# EAGLE design controlador_temperatura (EAGLE 9.6.2)
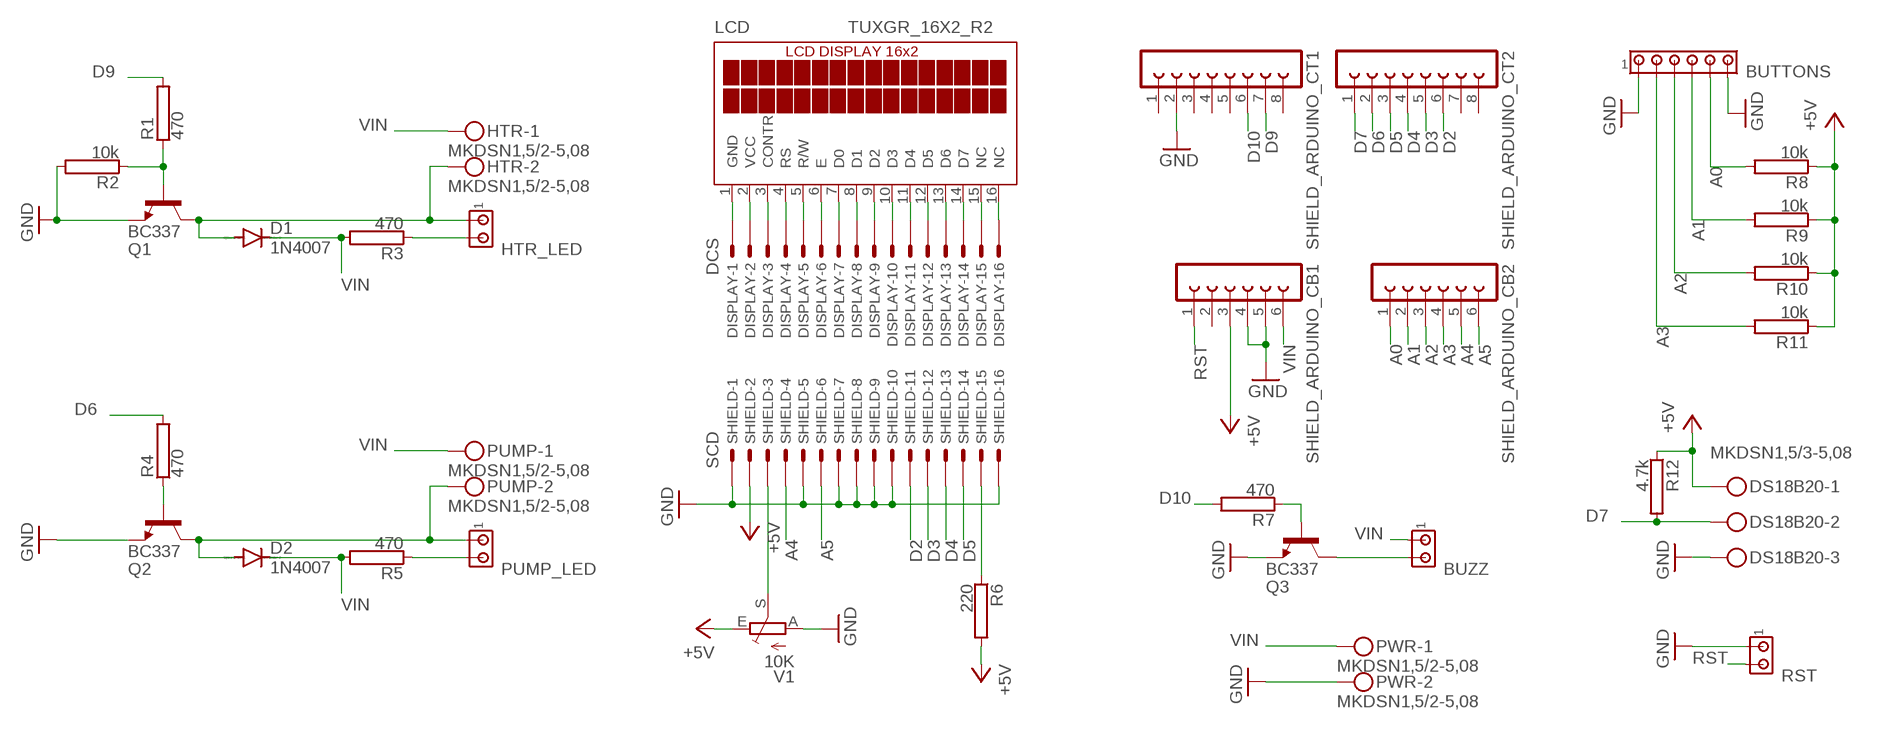
[diagram p0: schematic, sheet 1]

## Parts
BUTTONS  MTA06-100  [10X06MTA]
BUZZ  MTA02-100  [10X02MTA]
D1  1N4007  1N4004  [DO41-10]
D2  1N4007  1N4004  [DO41-10]
DISPLAY  DCS  057-016-1  [057-016-1]
DS18B20  MKDSN1,5/3-5,08  [MKDSN1,5/3-5,08]
HTR  MKDSN1,5/2-5,08  [MKDSN1,5/2-5,08]
HTR_LED  MTA02-100  [10X02MTA]
LCD  TUXGR_16X2_R2  [TUXGR_16X2_R2]
PUMP  MKDSN1,5/2-5,08  [MKDSN1,5/2-5,08]
PUMP_LED  MTA02-100  [10X02MTA]
PWR  MKDSN1,5/2-5,08  [MKDSN1,5/2-5,08]
Q1  BC337  [TO92]
Q2  BC337  [TO92]
Q3  BC337  [TO92]
R1  470  RRS1/8  [RS1/8]
R2  10k  RRS1/8  [RS1/8]
R3  470  RRS1/8  [RS1/8]
R4  470  RRS1/8  [RS1/8]
R5  470  RRS1/8  [RS1/8]
R6  220  RRS1/8  [RS1/8]
R7  470  RRS1/8  [RS1/8]
R8  10k  RRS1/8  [RS1/8]
R9  10k  RRS1/8  [RS1/8]
R10  10k  RRS1/8  [RS1/8]
R11  10k  RRS1/8  [RS1/8]
R12  4.7k  RRS1/8  [RS1/8]
RST  MTA02-100  [10X02MTA]
SHIELD  SCD  057-016-1  [057-016-1]
SHIELD_ARDUINO_CB1  FE06-1  [FE06]
SHIELD_ARDUINO_CB2  FE06-1  [FE06]
SHIELD_ARDUINO_CT1  FE08-1  [FE08]
SHIELD_ARDUINO_CT2  FE08-1  [FE08]
V1  10K  TRIM_EU-B25P  [B25P]

## Nets
A0: BUTTONS.5 R8.2 SHIELD_ARDUINO_CB2.1
A1: BUTTONS.4 R9.2 SHIELD_ARDUINO_CB2.2
A2: BUTTONS.3 R10.2 SHIELD_ARDUINO_CB2.3
A3: BUTTONS.2 R11.2 SHIELD_ARDUINO_CB2.4
A4: SHIELD.4 SHIELD_ARDUINO_CB2.5
A5: SHIELD.6 SHIELD_ARDUINO_CB2.6
D2: SHIELD.11 SHIELD_ARDUINO_CT2.6
D3: SHIELD.12 SHIELD_ARDUINO_CT2.5
D4: SHIELD.13 SHIELD_ARDUINO_CT2.4
D5: SHIELD.14 SHIELD_ARDUINO_CT2.3
D6: R4.2 SHIELD_ARDUINO_CT2.2
D7: DS18B20.2 R12.2 SHIELD_ARDUINO_CT2.1
D9: R1.2 SHIELD_ARDUINO_CT1.7
D10: R7.2 SHIELD_ARDUINO_CT1.6
GND: BUTTONS.1 BUTTONS.6 DS18B20.3 PWR.2 Q1.1(E) Q2.1(E) Q3.1(E) R2.2 RST.1 SHIELD.1 SHIELD.5 SHIELD.7 SHIELD.8 SHIELD.9 SHIELD.10 SHIELD.16 SHIELD_ARDUINO_CB1.4 SHIELD_ARDUINO_CB1.5 SHIELD_ARDUINO_CT1.2 V1.A
N$1: Q1.2(B) R1.1 R2.1
N$2: Q2.2(B) R4.1
N$3: D1.A HTR.2 HTR_LED.1 Q1.3(C)
N$4: D2.A PUMP.2 PUMP_LED.1 Q2.3(C)
N$5: HTR_LED.2 R3.1
N$6: PUMP_LED.2 R5.1
N$7: DISPLAY.1 LCD.1(GND)
N$8: Q3.2(B) R7.1
N$9: BUZZ.2 Q3.3(C)
N$10: DISPLAY.2 LCD.2(VCC)
N$11: DISPLAY.3 LCD.3(CONTR)
N$12: DISPLAY.4 LCD.4(RS)
N$13: DISPLAY.5 LCD.5(R/W)
N$14: DISPLAY.6 LCD.6(E)
N$15: DISPLAY.7 LCD.7(D0)
N$16: DISPLAY.8 LCD.8(D1)
N$17: DISPLAY.9 LCD.9(D2)
N$18: DISPLAY.10 LCD.10(D3)
N$19: DISPLAY.11 LCD.11(D4)
N$20: DISPLAY.12 LCD.12(D5)
N$21: DISPLAY.13 LCD.13(D6)
N$22: DISPLAY.14 LCD.14(D7)
N$23: DISPLAY.15 LCD.15(NC)
N$24: DISPLAY.16 LCD.16(NC)
N$25: R6.1 SHIELD.15
N$26: SHIELD.3 V1.S
RST: RST.2 SHIELD_ARDUINO_CB1.1
VCC: DS18B20.1 R6.2 R8.1 R9.1 R10.1 R11.1 R12.1 SHIELD.2 SHIELD_ARDUINO_CB1.3 V1.E ; supply symbol labelled +5V
VIN: BUZZ.1 D1.C D2.C HTR.1 PUMP.1 PWR.1 R3.2 R5.2 SHIELD_ARDUINO_CB1.6
Unconnected: SHIELD_ARDUINO_CB1.2 SHIELD_ARDUINO_CT1.1 SHIELD_ARDUINO_CT1.3 SHIELD_ARDUINO_CT1.4 SHIELD_ARDUINO_CT1.5 SHIELD_ARDUINO_CT1.8 SHIELD_ARDUINO_CT2.7 SHIELD_ARDUINO_CT2.8

## Library data of the parts
BUTTONS = con-amp:MTA06-100: AMP connector Connection corrected 2014-09-19
BUZZ HTR_LED PUMP_LED RST = con-amp:MTA02-100: AMP connector
D1 D2 = diode:1N4004: DIODE general purpose rectifier, 1 A
DISPLAY SHIELD = con-panduit:057-016-: CONNECTOR 10-pin series 057 contact pc board low profile headers; OC_FARNELL: unknown; OC_NEWARK: unknown
DS18B20 = con-phoenix-508:MKDSN1,5/3-5,08: MKDSN 1,5/ 3-5,08 Printklemme Nennstrom: 13,5 A Nennspannung: 250 V Rastermaß: 5,08 mm Polzahl: 3 Anschlussart: Schraubanschluss Montage: Löten Anschlussrichtung Leiter/Platine: 0 ° Artikelnummer: 1729131 Source: http://eshop.phoenixcontact.com .. 1729131.pdf
HTR PUMP PWR = con-phoenix-508:MKDSN1,5/2-5,08: MKDSN 1,5/ 2-5,08 Printklemme Nennstrom: 13,5 A Nennspannung: 250 V Rastermaß: 5,08 mm Polzahl: 2 Anschlussart: Schraubanschluss Montage: Löten Anschlussrichtung Leiter/Platine: 0 ° Artikelnummer: 1729128 Source: http://eshop.phoenixcontact.com .. 1729128.pdf
LCD = display-lcd:TUXGR_16X2_R2: Tuxgraphics LCD display 16x2 characters reflective, without background light Source: tuxgr_12x2_r2.pdf; OC_FARNELL: unknown; OC_NEWARK: unknown
Q1-Q3 = transistor-npn:BC337*: NPN Transistor
R1-R12 = resistor-power:R: Power Resitor; OC_FARNELL: unknown; OC_NEWARK: unknown
SHIELD_ARDUINO_CB1 SHIELD_ARDUINO_CB2 = con-lsta:FE06-1: FEMALE HEADER; OC_FARNELL: unknown; OC_NEWARK: unknown
SHIELD_ARDUINO_CT1 SHIELD_ARDUINO_CT2 = con-lsta:FE08-1: FEMALE HEADER; OC_FARNELL: unknown; OC_NEWARK: unknown
V1 = pot:TRIM_EU-: POTENTIOMETER

## Board
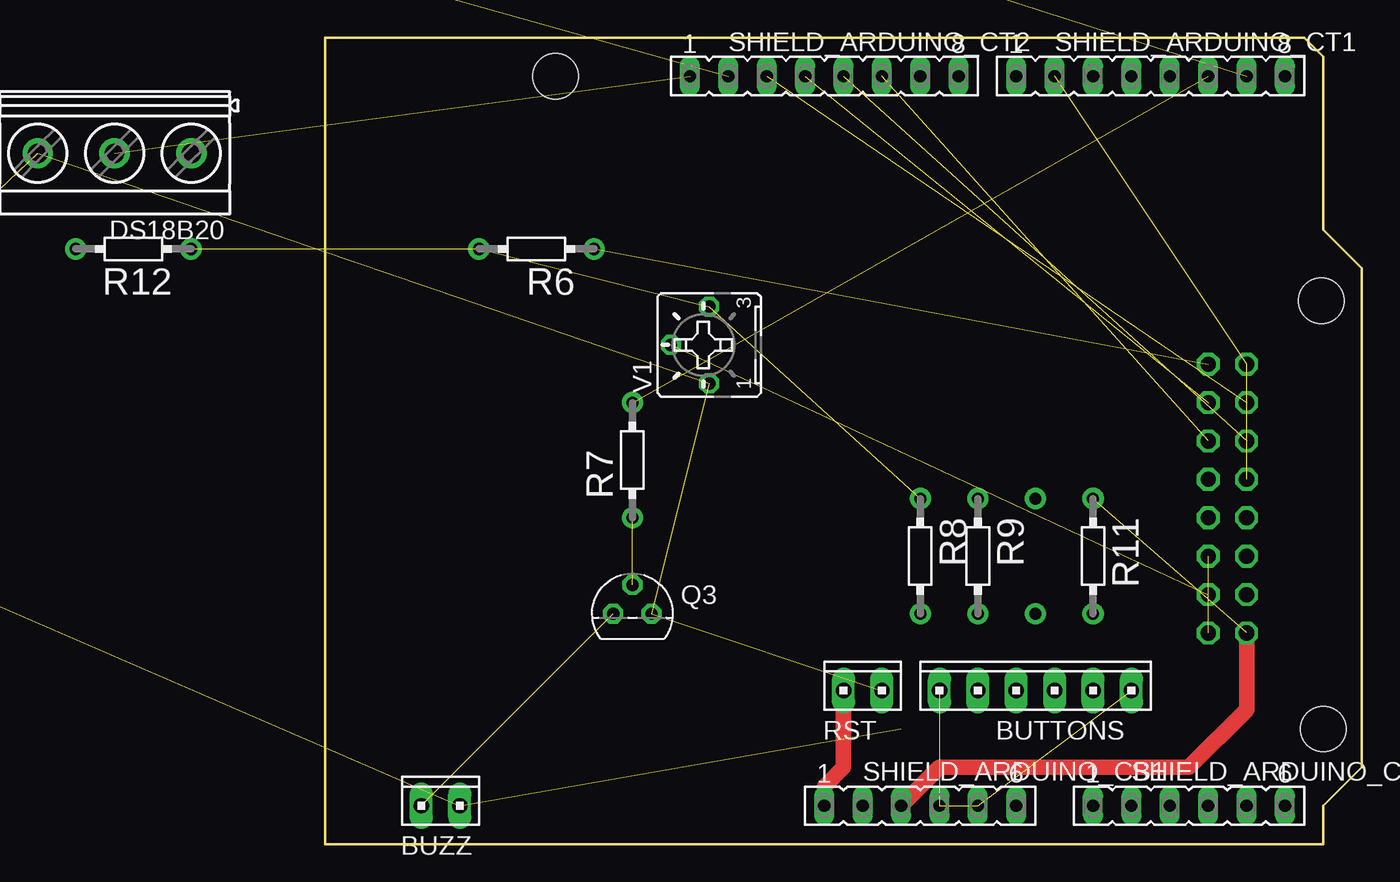
[diagram p1: board, top side]
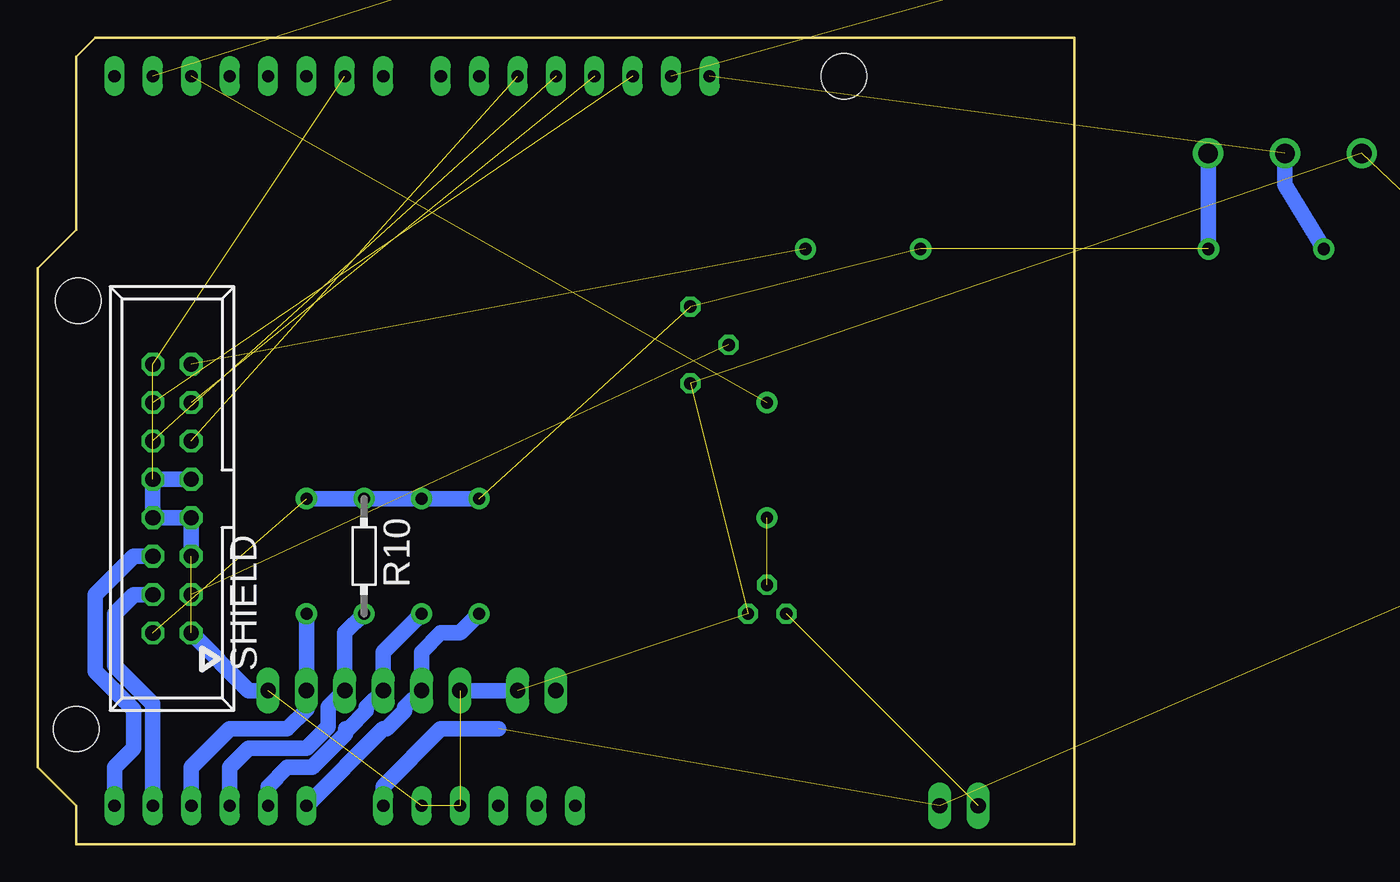
[diagram p2: board, bottom side, seen from below]

Size 68.58 x 53.34 mm. Coordinates in mm from the lower left corner, seen from the top.
Outline: 0,0 0,53.34 64.77,53.34 66.04,52.07 66.04,40.64 68.58,38.1 68.58,5.08 66.04,2.54 66.04,0 0,0
Copper layers (1*16): Top 0.035mm / dielectric 1.5mm / Bottom 0.035mm
Design rules "default": minimum track width 6mil, minimum drill 0.35mm, track to track 6mil, track to pad 6mil, pad to pad 6mil, via to via 6mil, smd to smd 6mil, copper to edge 40mil, drill to drill 6mil, minimum pad ring 10mil, minimum via ring 8mil, stop-mask expansion 4mil, vias tented up to drill 0mil, thermal gap 10mil
Holes 3 mm at 15.24,50.8 65.91,35.94 66.04,7.62

### Footprints (pad centres in the part's own frame; a part is rotated, then mirrored left to right if it is on the bottom)
10X06MTA = drill 1.016 long: 1 6.35,0; 2 3.81,0; 3 1.27,0; 4 -1.27,0; 5 -3.81,0; 6 -6.35,0
10X02MTA = drill 1.016 long: 1 1.27,0; 2 -1.27,0
DO41-10 = drill 1.118: A 5.08,0; C -5.08,0
057-016-1 = drill 1 octagon: 1 -8.89,-1.27; 2 -8.89,1.27; 3 -6.35,-1.27; 4 -6.35,1.27; 5 -3.81,-1.27; 6 -3.81,1.27; 7 -1.27,-1.27; 8 -1.27,1.27; 9 1.27,-1.27; 10 1.27,1.27; 11 3.81,-1.27; 12 3.81,1.27; 13 6.35,-1.27; 14 6.35,1.27; 15 8.89,-1.27; 16 8.89,1.27
MKDSN1,5/3-5,08 = drill 1.3 pad 2: 1 -7.641,0.025; 2 -2.561,0.025; 3 2.519,0.025
MKDSN1,5/2-5,08 = drill 1.3 pad 2: 1 -2.561,0.025; 2 2.519,0.025
TUXGR_16X2_R2 = drill 1 pad 1.676: 1 -32,15.5; 2 -29.46,15.5; 3 -26.92,15.5; 4 -24.38,15.5; 5 -21.84,15.5; 6 -19.3,15.5; 7 -16.76,15.5; 8 -14.22,15.5; 9 -11.68,15.5; 10 -9.14,15.5; 11 -6.6,15.5; 12 -4.06,15.5; 13 -1.52,15.5; 14 1.02,15.5; 15 3.56,15.5; 16 6.1,15.5 | hole 2.5: -37.5,-15.5; 37.5,-15.5; -37.5,15.5; 37.5,15.5
TO92 = drill 0.813 octagon: 1 1.27,0; 2 0,1.905; 3 -1.27,0
RS1/8 = drill 0.8 pad 1.4: 1 -3.81,0; 2 3.81,0
FE06 = drill 0.813 long: 1 -6.35,0; 2 -3.81,0; 3 -1.27,0; 4 1.27,0; 5 3.81,0; 6 6.35,0
FE08 = drill 0.813 long: 1 -8.89,0; 2 -6.35,0; 3 -3.81,0; 4 -1.27,0; 5 1.27,0; 6 3.81,0; 7 6.35,0; 8 8.89,0
B25P = drill 0.813 octagon: A -2.54,0; E 2.54,0; S 0,2.54

### Placement (x,y rotation side)
BUTTONS  46.99,10.16 0 top
BUZZ  7.62,2.54 0 top
D1  -104.14,123.19 90 top  (outside the outline)
D2  -46.99,60.96 90 top  (outside the outline)
DISPLAY  -125.73,-21.59 0 top  (outside the outline)
DS18B20  -16.51,45.72 180 top  (outside the outline)
HTR  -83.82,120.65 90 top  (outside the outline)
HTR_LED  -83.82,138.43 270 top  (outside the outline)
LCD  -109.22,-5.08 0 top  (outside the outline)
PUMP  -33.02,60.96 90 top  (outside the outline)
PUMP_LED  -33.02,72.39 270 top  (outside the outline)
PWR  -40.64,22.86 0 bottom  (outside the outline)
Q1  -115.57,121.92 270 bottom  (outside the outline)
Q2  -73.66,64.77 270 bottom  (outside the outline)
Q3  20.32,15.24 0 top
R1  -118.11,111.76 270 top  (outside the outline)
R2  -125.73,123.19 270 bottom  (outside the outline)
R3  -93.98,133.35 270 top  (outside the outline)
R4  -77.47,76.2 90 top  (outside the outline)
R5  -58.42,64.77 270 top  (outside the outline)
R6  13.97,39.37 180 top
R7  20.32,25.4 90 top
R8  39.37,19.05 270 top
R9  43.18,19.05 270 top
R10  46.99,19.05 270 bottom
R11  50.8,19.05 270 top
R12  -12.7,39.37 180 top  (outside the outline)
RST  35.56,10.16 0 top
SHIELD  59.69,22.86 90 bottom
SHIELD_ARDUINO_CB1  39.37,2.54 0 top
SHIELD_ARDUINO_CB2  57.15,2.54 0 top
SHIELD_ARDUINO_CT1  54.61,50.8 0 top
SHIELD_ARDUINO_CT2  33.02,50.8 0 top
V1  25.4,33.02 90 top

### Tracks (layer width: path | path; a pad name or v marks a point on that pad's centre or on a via)
A0
  Bottom 1.016: R8.2 40.64,13.97 41.91,13.97 43.18,12.7 BUTTONS.5 44.3,9.04 44.3,8.81 45.49,7.62 45.72,7.62 SHIELD_ARDUINO_CB2.1
A1
  Bottom 1.016: R9.2 45.72,12.7 BUTTONS.4 46.84,9.04 46.84,8.81 48.03,7.62 48.21,7.62 48.21,7.29 50.42,5.08 52.07,5.08 53.34,3.81 SHIELD_ARDUINO_CB2.2
A2
  Bottom 1.016: R10.2 48.26,13.97 BUTTONS.3 49.38,9.04 49.38,7.77 50.8,6.35 54.61,6.35 55.88,5.08 SHIELD_ARDUINO_CB2.3
A3
  Bottom 1.016: R11.2 BUTTONS.2 50.8,8.89 52.07,7.62 55.88,7.62 58.42,5.08 SHIELD_ARDUINO_CB2.4
A4
  Bottom 1.016: SHIELD.4 62.23,16.51 63.5,15.24 63.5,11.81 60.96,9.27 SHIELD_ARDUINO_CB2.5
A5
  Bottom 1.016: SHIELD_ARDUINO_CB2.6 63.5,5.08 62.23,6.35 62.23,8.89 64.77,11.43 64.77,16.51 62.23,19.05 SHIELD.6
D2  (1 unrouted)
D3  (1 unrouted)
D4  (1 unrouted)
D5  (1 unrouted)
D6  (1 unrouted)
D7  (1 unrouted)
  Bottom 1.016: DS18B20.2 -13.95,43.61 R12.2
D9  (1 unrouted)
D10  (1 unrouted)
GND  (13 unrouted)
  Bottom 1.016: SHIELD.5 SHIELD.7 SHIELD.8 SHIELD.10 SHIELD.9 | BUTTONS.1 54.61,10.16 SHIELD.1 | RST.1 BUTTONS.6
N$1  (2 unrouted)
N$2  (1 unrouted)
N$3  (3 unrouted)
N$4  (3 unrouted)
N$5  (1 unrouted)
N$6  (1 unrouted)
N$7  (1 unrouted)
N$8  (1 unrouted)
N$9  (1 unrouted)
N$10  (1 unrouted)
N$11  (1 unrouted)
N$12  (1 unrouted)
N$13  (1 unrouted)
N$14  (1 unrouted)
N$15  (1 unrouted)
N$16  (1 unrouted)
N$17  (1 unrouted)
N$18  (1 unrouted)
N$19  (1 unrouted)
N$20  (1 unrouted)
N$21  (1 unrouted)
N$22  (1 unrouted)
N$23  (1 unrouted)
N$24  (1 unrouted)
N$25  (1 unrouted)
N$26  (1 unrouted)
RST
  Top 1.016: SHIELD_ARDUINO_CB1.1 33.02,3.81 34.29,5.08 RST.2
VCC  (4 unrouted)
  Top 1.016: SHIELD_ARDUINO_CB1.3 40.64,5.08 57.15,5.08 60.96,8.89 SHIELD.2
  Bottom 1.016: R12.1 -8.87,39.39 DS18B20.1 | R9.1 R8.1 R10.1 R11.1
VIN  (8 unrouted)
  Bottom 1.016: SHIELD_ARDUINO_CB1.6 45.72,3.81 41.91,7.62 38.1,7.62